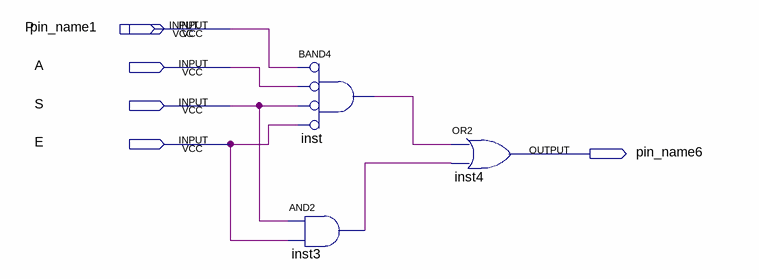
[diagram p0: schematic sheet]
// Quartus schematic Block1.bdf as structural Verilog: 3 symbols, 6 pins
module Block1 (
  input  P,
  input  pin_name1,
  input  A,
  input  S,
  input  E,
  output pin_name6
);

  wire inst3_out, inst_out;

  and inst (inst_out, ~pin_name1, ~A, ~S, ~E);  // BAND4
  and inst3 (inst3_out, S, E);
  or inst4 (pin_name6, inst_out, inst3_out);
endmodule
